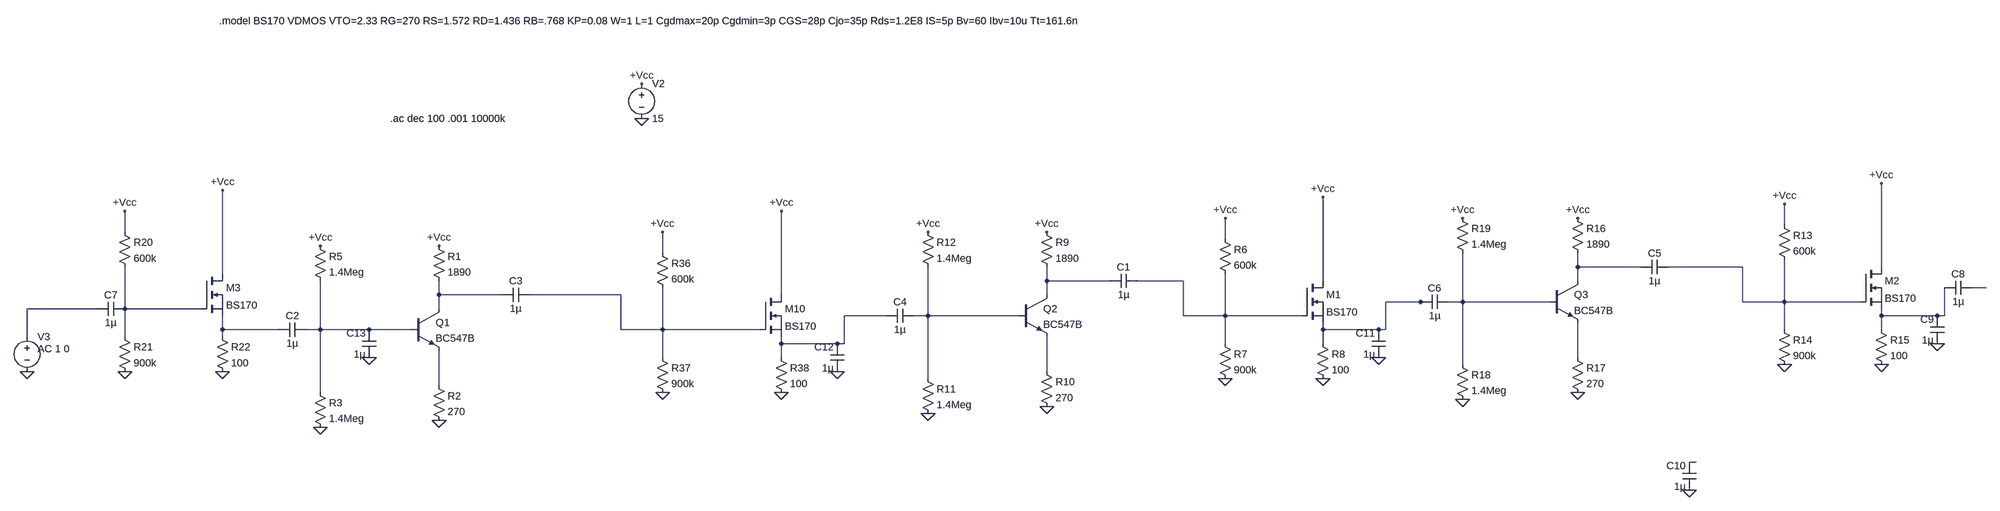
[diagram p0: schematic lab6.asc]
lab6.asc, the LTspice schematic file:
Version 4
SHEET 1 4084 732
WIRE 2160 -1424 2160 -1472
WIRE -1888 -1408 -1888 -1456
WIRE 784 -1392 784 -1440
WIRE -608 -1360 -608 -1408
WIRE 1648 -1328 1648 -1360
WIRE 1792 -1328 1648 -1328
WIRE 2064 -1328 1856 -1328
WIRE 2432 -1328 2432 -1520
WIRE -1616 -1312 -1616 -1504
WIRE 272 -1296 272 -1328
WIRE 416 -1296 272 -1296
WIRE 688 -1296 480 -1296
WIRE 1056 -1296 1056 -1488
WIRE 1648 -1296 1648 -1328
WIRE 2672 -1280 2640 -1280
WIRE -1120 -1264 -1120 -1296
WIRE -976 -1264 -1120 -1264
WIRE -704 -1264 -912 -1264
WIRE -336 -1264 -336 -1456
WIRE 272 -1264 272 -1296
WIRE 1280 -1248 1200 -1248
WIRE 1296 -1248 1280 -1248
WIRE 1376 -1248 1376 -1360
WIRE 1376 -1248 1344 -1248
WIRE 1584 -1248 1376 -1248
WIRE 2064 -1248 2064 -1328
WIRE 2160 -1248 2160 -1344
WIRE 2160 -1248 2064 -1248
WIRE 2384 -1248 2160 -1248
WIRE -1952 -1232 -2112 -1232
WIRE -1888 -1232 -1888 -1328
WIRE -1664 -1232 -1888 -1232
WIRE -1120 -1232 -1120 -1264
WIRE -96 -1216 -192 -1216
WIRE 0 -1216 0 -1328
WIRE 0 -1216 -32 -1216
WIRE 208 -1216 0 -1216
WIRE 688 -1216 688 -1296
WIRE 784 -1216 784 -1312
WIRE 784 -1216 688 -1216
WIRE 1008 -1216 784 -1216
WIRE 2432 -1216 2432 -1232
WIRE 2560 -1216 2432 -1216
WIRE 2576 -1216 2576 -1280
WIRE 2576 -1216 2560 -1216
WIRE -1616 -1184 -1616 -1216
WIRE -1488 -1184 -1616 -1184
WIRE -1392 -1184 -1392 -1296
WIRE -1392 -1184 -1424 -1184
WIRE -1280 -1184 -1392 -1184
WIRE -1184 -1184 -1280 -1184
WIRE -704 -1184 -704 -1264
WIRE -608 -1184 -608 -1280
WIRE -608 -1184 -704 -1184
WIRE -384 -1184 -608 -1184
WIRE 1056 -1184 1056 -1200
WIRE 1184 -1184 1056 -1184
WIRE 1200 -1184 1200 -1248
WIRE 1200 -1184 1184 -1184
WIRE 2160 -1184 2160 -1248
WIRE 2432 -1184 2432 -1216
WIRE -2112 -1168 -2112 -1232
WIRE -1888 -1168 -1888 -1232
WIRE -1616 -1168 -1616 -1184
WIRE -336 -1152 -336 -1168
WIRE -208 -1152 -336 -1152
WIRE -192 -1152 -192 -1216
WIRE -192 -1152 -208 -1152
WIRE 784 -1152 784 -1216
WIRE 1056 -1152 1056 -1184
WIRE -608 -1120 -608 -1184
WIRE -336 -1120 -336 -1152
WIRE 1648 -1120 1648 -1200
WIRE 1376 -1104 1376 -1248
WIRE 272 -1088 272 -1168
WIRE 0 -1072 0 -1216
WIRE -1120 -1056 -1120 -1136
WIRE -1392 -1040 -1392 -1184
WIRE 1920 -880 1904 -880
FLAG -656 -1760 0
FLAG -656 -1840 +Vcc
FLAG -608 -1408 +Vcc
FLAG -336 -1456 +Vcc
FLAG -1120 -976 0
FLAG -1392 -960 0
FLAG -1392 -1376 +Vcc
FLAG -1120 -1376 +Vcc
FLAG -336 -1040 0
FLAG -608 -1040 0
FLAG 784 -1440 +Vcc
FLAG 1056 -1488 +Vcc
FLAG 272 -1008 0
FLAG 0 -992 0
FLAG 0 -1408 +Vcc
FLAG 272 -1408 +Vcc
FLAG 1056 -1072 0
FLAG 784 -1072 0
FLAG 2160 -1472 +Vcc
FLAG 2432 -1520 +Vcc
FLAG 1648 -1040 0
FLAG 1376 -1024 0
FLAG 1376 -1440 +Vcc
FLAG 1648 -1440 +Vcc
FLAG 2432 -1104 0
FLAG 2160 -1104 0
FLAG -1888 -1456 +Vcc
FLAG -1616 -1504 +Vcc
FLAG -1616 -1088 0
FLAG -1888 -1088 0
FLAG -2112 -1088 0
FLAG 2560 -1152 0
FLAG 1904 -816 0
FLAG 1184 -1120 0
FLAG -208 -1088 0
FLAG -1280 -1120 0
SYMBOL voltage -656 -1856 R0
WINDOW 123 0 0 Left 0
WINDOW 39 0 0 Left 0
SYMATTR InstName V2
SYMATTR Value 15
SYMBOL nmos -384 -1264 R0
SYMATTR InstName M10
SYMATTR Value BS170
SYMBOL res -624 -1376 R0
SYMATTR InstName R36
SYMATTR Value 600k
SYMBOL res -624 -1136 R0
SYMATTR InstName R37
SYMATTR Value 900k
SYMBOL res -352 -1136 R0
SYMATTR InstName R38
SYMATTR Value 100
SYMBOL npn -1184 -1232 R0
SYMATTR InstName Q1
SYMATTR Value BC547B
SYMBOL res -1136 -1392 R0
SYMATTR InstName R1
SYMATTR Value 1890
SYMBOL res -1136 -1072 R0
SYMATTR InstName R2
SYMATTR Value 270
SYMBOL res -1408 -1056 R0
SYMATTR InstName R3
SYMATTR Value 1.4Meg
SYMBOL res -1408 -1392 R0
SYMATTR InstName R5
SYMATTR Value 1.4Meg
SYMBOL cap -912 -1280 R90
WINDOW 0 0 32 VBottom 2
WINDOW 3 32 32 VTop 2
SYMATTR InstName C3
SYMATTR Value 1µ
SYMBOL cap -1424 -1200 R90
WINDOW 0 0 32 VBottom 2
WINDOW 3 32 32 VTop 2
SYMATTR InstName C2
SYMATTR Value 1µ
SYMBOL nmos 1008 -1296 R0
SYMATTR InstName M1
SYMATTR Value BS170
SYMBOL res 768 -1408 R0
SYMATTR InstName R6
SYMATTR Value 600k
SYMBOL res 768 -1168 R0
SYMATTR InstName R7
SYMATTR Value 900k
SYMBOL res 1040 -1168 R0
SYMATTR InstName R8
SYMATTR Value 100
SYMBOL npn 208 -1264 R0
SYMATTR InstName Q2
SYMATTR Value BC547B
SYMBOL res 256 -1424 R0
SYMATTR InstName R9
SYMATTR Value 1890
SYMBOL res 256 -1104 R0
SYMATTR InstName R10
SYMATTR Value 270
SYMBOL res -16 -1088 R0
SYMATTR InstName R11
SYMATTR Value 1.4Meg
SYMBOL res -16 -1424 R0
SYMATTR InstName R12
SYMATTR Value 1.4Meg
SYMBOL cap 480 -1312 R90
WINDOW 0 0 32 VBottom 2
WINDOW 3 32 32 VTop 2
SYMATTR InstName C1
SYMATTR Value 1µ
SYMBOL cap -32 -1232 R90
WINDOW 0 0 32 VBottom 2
WINDOW 3 32 32 VTop 2
SYMATTR InstName C4
SYMATTR Value 1µ
SYMBOL nmos 2384 -1328 R0
SYMATTR InstName M2
SYMATTR Value BS170
SYMBOL res 2144 -1440 R0
SYMATTR InstName R13
SYMATTR Value 600k
SYMBOL res 2144 -1200 R0
SYMATTR InstName R14
SYMATTR Value 900k
SYMBOL res 2416 -1200 R0
SYMATTR InstName R15
SYMATTR Value 100
SYMBOL npn 1584 -1296 R0
SYMATTR InstName Q3
SYMATTR Value BC547B
SYMBOL res 1632 -1456 R0
SYMATTR InstName R16
SYMATTR Value 1890
SYMBOL res 1632 -1136 R0
SYMATTR InstName R17
SYMATTR Value 270
SYMBOL res 1360 -1120 R0
SYMATTR InstName R18
SYMATTR Value 1.4Meg
SYMBOL res 1360 -1456 R0
SYMATTR InstName R19
SYMATTR Value 1.4Meg
SYMBOL cap 1856 -1344 R90
WINDOW 0 0 32 VBottom 2
WINDOW 3 32 32 VTop 2
SYMATTR InstName C5
SYMATTR Value 1µ
SYMBOL cap 1344 -1264 R90
WINDOW 0 0 32 VBottom 2
WINDOW 3 32 32 VTop 2
SYMATTR InstName C6
SYMATTR Value 1µ
SYMBOL nmos -1664 -1312 R0
SYMATTR InstName M3
SYMATTR Value BS170
SYMBOL res -1904 -1424 R0
SYMATTR InstName R20
SYMATTR Value 600k
SYMBOL res -1904 -1184 R0
SYMATTR InstName R21
SYMATTR Value 900k
SYMBOL res -1632 -1184 R0
SYMATTR InstName R22
SYMATTR Value 100
SYMBOL cap -1888 -1248 R90
WINDOW 0 0 32 VBottom 2
WINDOW 3 32 32 VTop 2
SYMATTR InstName C7
SYMATTR Value 1µ
SYMBOL cap 2640 -1296 R90
WINDOW 0 0 32 VBottom 2
WINDOW 3 32 32 VTop 2
SYMATTR InstName C8
SYMATTR Value 1µ
SYMBOL voltage -2112 -1184 R0
WINDOW 123 24 44 Left 2
WINDOW 39 0 0 Left 0
SYMATTR InstName V3
SYMATTR Value ""
SYMATTR Value2 AC 1 0
SYMBOL cap 2576 -1152 R180
WINDOW 0 24 56 Left 2
WINDOW 3 24 8 Left 2
SYMATTR InstName C9
SYMATTR Value 1µ
SYMBOL cap 1920 -816 R180
WINDOW 0 24 56 Left 2
WINDOW 3 24 8 Left 2
SYMATTR InstName C10
SYMATTR Value 1µ
SYMBOL cap 1200 -1120 R180
WINDOW 0 24 56 Left 2
WINDOW 3 24 8 Left 2
SYMATTR InstName C11
SYMATTR Value 1µ
SYMBOL cap -192 -1088 R180
WINDOW 0 24 56 Left 2
WINDOW 3 24 8 Left 2
SYMATTR InstName C12
SYMATTR Value 1µ
SYMBOL cap -1264 -1120 R180
WINDOW 0 24 56 Left 2
WINDOW 3 24 8 Left 2
SYMATTR InstName C13
SYMATTR Value 1µ
TEXT -1232 -1760 Left 2 !.ac dec 100 .001 10000k
TEXT -1624 -2048 Left 2 !.model BS170 VDMOS VTO=2.33 RG=270 RS=1.572 RD=1.436 RB=.768 KP=0.08 W=1 L=1 Cgdmax=20p Cgdmin=3p CGS=28p Cjo=35p Rds=1.2E8 IS=5p Bv=60 Ibv=10u Tt=161.6n

The netlist it stands for:
* lab6.asc
V2 +Vcc 0 15
M10 +Vcc N007 N012 N012 BS170
R36 +Vcc N007 600k
R37 N007 0 900k
R38 N012 0 100
Q1 N006 N016 N019 0 BC547B
R1 +Vcc N006 1890
R2 N019 0 270
R3 N016 0 1.4Meg
R5 +Vcc N016 1.4Meg
C3 N007 N006 1µ
C2 N016 N015 1µ
M1 +Vcc N004 N008 N008 BS170
R6 +Vcc N004 600k
R7 N004 0 900k
R8 N008 0 100
Q2 N003 N013 N018 0 BC547B
R9 +Vcc N003 1890
R10 N018 0 270
R11 N013 0 1.4Meg
R12 +Vcc N013 1.4Meg
C1 N004 N003 1µ
C4 N013 N012 1µ
M2 +Vcc N002 N014 N014 BS170
R13 +Vcc N002 600k
R14 N002 0 900k
R15 N014 0 100
Q3 N001 N009 N017 0 BC547B
R16 +Vcc N001 1890
R17 N017 0 270
R18 N009 0 1.4Meg
R19 +Vcc N009 1.4Meg
C5 N002 N001 1µ
C6 N009 N008 1µ
M3 +Vcc N011 N015 N015 BS170
R20 +Vcc N011 600k
R21 N011 0 900k
R22 N015 0 100
C7 N011 N010 1µ
C8 N005 N014 1µ
V3 N010 0 AC 1 0
C9 0 N014 1µ
C10 0 N020 1µ
C11 0 N008 1µ
C12 0 N012 1µ
C13 0 N016 1µ
.model NPN NPN
.model PNP PNP
.lib standard.bjt
.model NMOS NMOS
.model PMOS PMOS
.lib standard.mos
.ac dec 100 .001 10000k
.model BS170 VDMOS VTO=2.33 RG=270 RS=1.572 RD=1.436 RB=.768 KP=0.08 W=1 L=1 Cgdmax=20p Cgdmin=3p CGS=28p Cjo=35p Rds=1.2E8 IS=5p Bv=60 Ibv=10u Tt=161.6n
.backanno
.end